# EAGLE design Helepolis_Level1 (EAGLE 6.4)
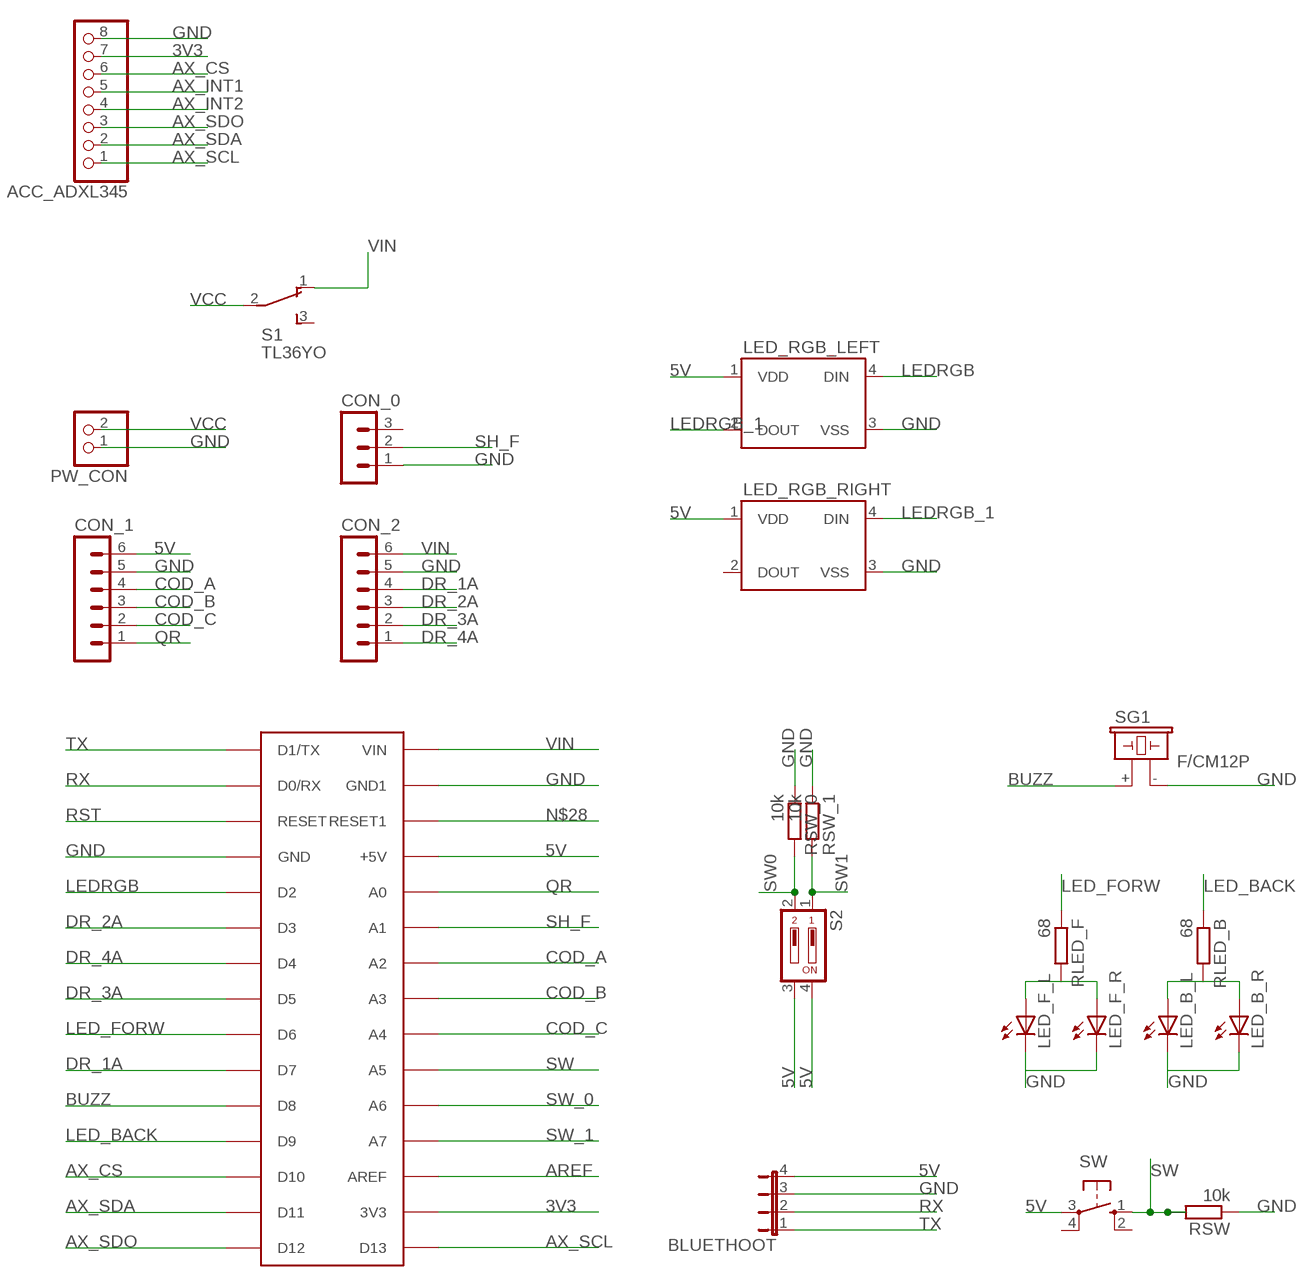
[diagram p0: schematic, sheet 1]

## Parts
ACC_ADXL345  PINHD-1X8  [1X08]
BLUETHOOT  JP4E  [JP4]
CON_0  MA03-1  [MA03-1]
CON_1  MA06-1  [MA06-1]
CON_2  MA06-1  [MA06-1]
LED_B_L  LED5MM  [LED5MM]
LED_B_R  LED5MM  [LED5MM]
LED_F_L  LED5MM  [LED5MM]
LED_F_R  LED5MM  [LED5MM]
LED_RGB_LEFT  WS2812B  [WS2812B]
LED_RGB_RIGHT  WS2812B  [WS2812B]
PW_CON  PINHD-1X2  [1X02]
RLED_B  68  R-EU_R1206  [R1206]
RLED_F  68  R-EU_R1206  [R1206]
RSW  10k  R-EU_R1206  [R1206]
RSW_0  10k  R-EU_R1206  [R1206]
RSW_1  10k  R-EU_R1206  [R1206]
S1  TL36YO  [TL3XYO]
S2  DP02  [DP-02]
SG1  F/CM12P  [F/CM12P]
SW  10-XX  [B3F-10XX]
U$1  ARDUINONANO  [PDIP-32]

## Nets
3V3: ACC_ADXL345.7 U$1.3V3
5V: BLUETHOOT.4 CON_1.6 LED_RGB_LEFT.1(VDD) LED_RGB_RIGHT.1(VDD) S2.3 S2.4 SW.3(P) U$1.+5V
AREF: U$1.AREF
AX_CS: ACC_ADXL345.6 U$1.D10
AX_INT1: ACC_ADXL345.5
AX_INT2: ACC_ADXL345.4
AX_SCL: ACC_ADXL345.1 U$1.D13
AX_SDA: ACC_ADXL345.2 U$1.D11
AX_SDO: ACC_ADXL345.3 U$1.D12
BUZZ: SG1.+ U$1.D8
COD_A: CON_1.4 U$1.A2
COD_B: CON_1.3 U$1.A3
COD_C: CON_1.2 U$1.A4
DR_1A: CON_2.4 U$1.D7
DR_2A: CON_2.3 U$1.D3
DR_3A: CON_2.2 U$1.D5
DR_4A: CON_2.1 U$1.D4
GND [GND]: ACC_ADXL345.8 BLUETHOOT.3 CON_0.1 CON_1.5 CON_2.5 LED_B_L.K(C) LED_B_R.K(C) LED_F_L.K(C) LED_F_R.K(C) LED_RGB_LEFT.3(VSS) LED_RGB_RIGHT.3(VSS) PW_CON.1 RSW.1 RSW_0.1 RSW_1.1 SG1.- U$1.GND U$1.GND1
LED_BACK: RLED_B.1 U$1.D9
LED_FORW: RLED_F.1 U$1.D6
LEDRGB: LED_RGB_LEFT.4(DIN) U$1.D2
LEDRGB_1: LED_RGB_LEFT.2(DOUT) LED_RGB_RIGHT.4(DIN)
N$4: LED_F_L.A LED_F_R.A RLED_F.2
N$5: LED_B_L.A LED_B_R.A RLED_B.2
N$28: U$1.RESET1
QR: CON_1.1 U$1.A0
RST: U$1.RESET
RX: BLUETHOOT.2 U$1.D0/RX
SH_F: CON_0.2 U$1.A1
SW: RSW.2 SW.1(S) U$1.A5
SW0: RSW_0.2 S2.2
SW1: RSW_1.2 S2.1
SW_0: U$1.A6
SW_1: U$1.A7
TX: BLUETHOOT.1 U$1.D1/TX
VCC [GND]: PW_CON.2 S1.2(P)
VIN [VCC]: CON_2.6 S1.1(O) U$1.VIN
Unconnected: CON_0.3 LED_RGB_RIGHT.2(DOUT) S1.3(S) SW.2(S1) SW.4(P1)

## Library data of the parts
ACC_ADXL345 = pinhead:PINHD-1X8: PIN HEADER
BLUETHOOT = jumper:JP4E: JUMPER
CON_0 = con-lstb:MA03-1: PIN HEADER; OC_FARNELL: unknown; OC_NEWARK: unknown
CON_1 CON_2 = con-lstb:MA06-1: PIN HEADER; OC_FARNELL: unknown; OC_NEWARK: unknown
LED_B_L LED_B_R LED_F_L LED_F_R = led:LED: LED OSRAM: - CHIPLED LG R971, LG N971, LY N971, LG Q971, LY Q971, LO R971, LY R971 LH N974, LH R974 LS Q976, LO Q976, LY Q976 LO Q996 - Hyper CHIPLED LW Q18S LB Q993, LB Q99A, LB R99A - SideLED LS A670, LO A670, LY A670, LG A670, LP A670 LB A673, LV A673, LT A673, LW A673 LH A674 LY A675 LS A676, LA A676, LO A676, LY A676, LW A676 LS A679, LY A679, LG A679 - Hyper Micro SIDELED® LS Y876, LA Y876, LO Y876, LY Y876 LT Y87S - SmartLED LW L88C, LW L88S LB L89C, LB L89S, LG L890 LS L89K, LO L89K, LY L89K LS L896, LA L896, LO L896, LY L896 - TOPLED LS T670, LO T670, LY T670, LG T670, LP T670 LSG T670, LSP T670, LSY T670, LOP T670, LYG T670 LG T671, LOG T671, LSG T671 LB T673, LV T673, LT T673, LW T673 LH T674 LS T676, LA T676, LO T676, LY T676, LB T676, LH T676, LSB T676, LW T676 LB T67C, LV T67C, LT T67C, LS T67K, LO T67K, LY T67K, LW E67C LS E67B, LA E67B, LO E67B, LY E67B, LB E67C, LV E67C, LT E67C LW T67C LS T679, LY T679, LG T679 LS T770, LO T770, LY T770, LG T770, LP T770 LB T773, LV T773, LT T773, LW T773 LH T774 LS E675, LA E675, LY E675, LS T675 LS T776, LA T776, LO T776, LY T776, LB T776 LHGB T686 LT T68C, LB T68C - Hyper Mini TOPLED® LB M676 - Mini TOPLED Santana® LG M470 LS M47K, LO M47K, LY M47K Source: http://www.osram.convergy.de LUXEON: - LUMILED® LXK2-PW12-R00, LXK2-PW12-S00, LXK2-PW14-U00, LXK2-PW14-V00 LXK2-PM12-R00, LXK2-PM12-S00, LXK2-PM14-U00 LXK2-PE12-Q00, LXK2-PE12-R00, LXK2-PE12-S00, LXK2-PE14-T00, LXK2-PE14-U00 LXK2-PB12-K00, LXK2-PB12-L00, LXK2-PB12-M00, LXK2-PB14-N00, LXK2-PB14-P00, LXK2-PB14-Q00 LXK2-PR12-L00, LXK2-PR12-M00, LXK2-PR14-Q00, LXK2-PR14-R00 LXK2-PD12-Q00, LXK2-PD12-R00, LXK2-PD12-S00 LXK2-PH12-R00, LXK2-PH12-S00 LXK2-PL12-P00, LXK2-PL12-Q00, LXK2-PL12-R00 Source: www.luxeon.com KINGBRIGHT: KA-3528ASYC Source: www.kingbright.com
LED_RGB_LEFT LED_RGB_RIGHT = SparkFun-LED_copia:WS2812B: WS2812B - Intelligent control LED integrated light source Technical Specifications: Power Supply Voltage (VDD): 3.5 to 5.3 V Input Voltage (VI): -0.5 to VDD+0.5 V Operating Junction Temperature (Topt): -25°C to +80°C Storage Temperature Range (Tstg): -55°C to +150°C
PW_CON = pinhead:PINHD-1X2: PIN HEADER
RLED_B RLED_F RSW RSW_0 RSW_1 = rcl:R-EU_: RESISTOR, European symbol
S1 = switch:TL36YO: TINY SWITCH ON - ON Source: http://www2.produktinfo.conrad.com/datenblaetter/700000-724999/705152-da-01-de-Subminiaturschalter_TL_36YO.pdf
S2 = switch-dil:DP02: DIL/CODE SWITCH; MPN: MCDP02; OC_FARNELL: 1255233; OC_NEWARK: 26M1095
SG1 = buzzer:F/CM12P: BUZZER Source: Buerklin; OC_FARNELL: unknown; OC_NEWARK: unknown
SW = switch-omron:10-XX: OMRON SWITCH; MPN: B3F-1000; OC_FARNELL: 176432; OC_NEWARK: 36M3542
U$1 = jet-lib:ARDUINONANO

## Net classes
1 GND: width 1.016 mm, clearance 0.305 mm
2 VCC: width 0.635 mm, clearance 0.305 mm to class 1

## Board
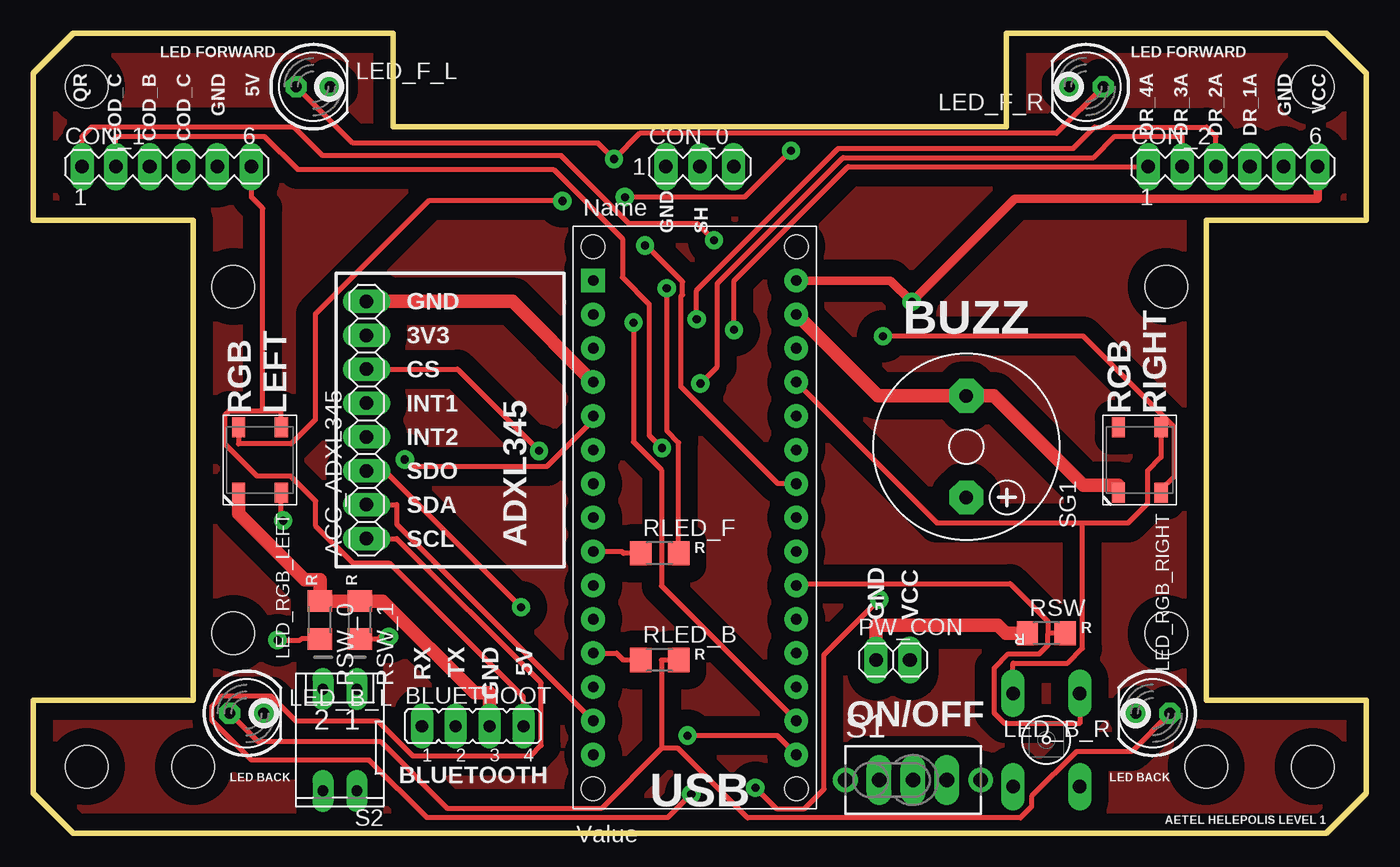
[diagram p1: board, top side]
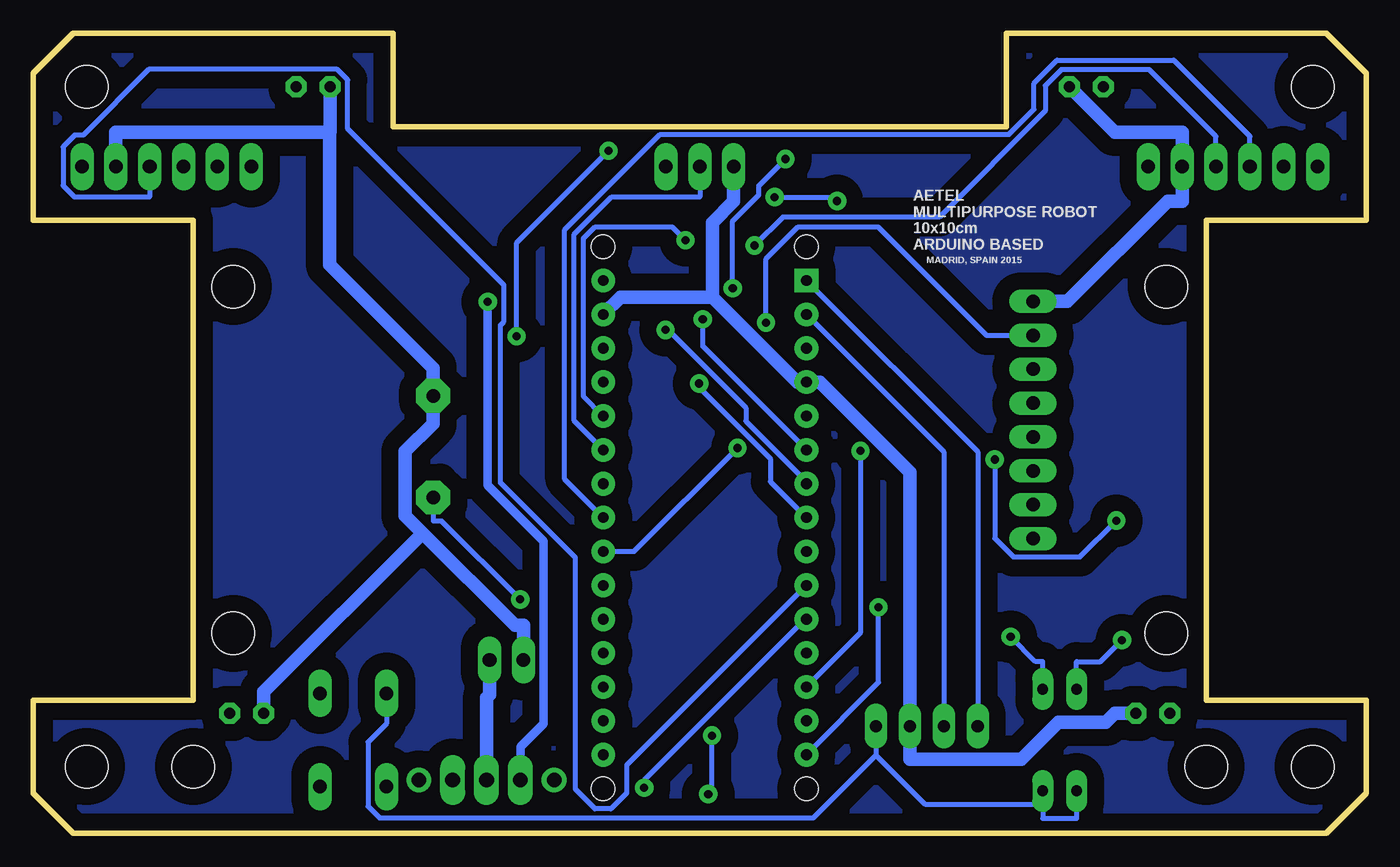
[diagram p2: board, bottom side, seen from below]

Size 100 x 60 mm. Coordinates in mm from the lower left corner, seen from the top.
Outline: 3,0 27,0
Outline: 73,0 97,0
Outline: 100,3 100,10
Outline: 100,46 100,57
Outline: 0,57 0,46
Outline: 0,10 0,3
Outline: 0,3 0,10
Outline: 0,46 12,46 12,43 12,25 12,10 0,10
Outline: 0,46 0,57
Outline: 100,57 100,46
Outline: 100,46 88,46 88,43 88,25 88,10 100,10
Outline: 100,10 100,3
Outline: 97,0 73,0
Outline: 27,0 3,0
Outline: 0,3 3,0
Outline: 100,3 97,0
Outline: 73,60 97,60 100,57
Outline: 73,0 67,0 51,0 35,0 28,0 27,0
Outline: 50,53 73,53
Outline: 73,53 73,60
Outline: 73,60 73,53
Outline: 73,53 27,53 27,60 26,60 3,60 0,57
Copper layers (1*16): Top 0.035mm / dielectric 1.5mm / Bottom 0.035mm
Design rules "default *": minimum track width 15mil, minimum drill 24mil, track to track 12mil, track to pad 12mil, pad to pad 12mil, via to via 12mil, smd to smd 8mil, copper to edge 40mil, drill to drill 8mil, minimum pad ring 15mil, minimum via ring 15mil, stop-mask expansion 4mil, vias tented up to drill 0mil, thermal gap 10mil
Holes 3.2 mm at 4,5 12,5 15,15 96,5 88,5 4,56 96,56 85,41 85,15 15,41
tRestrict: area 62,2 to 70,6; area 21,1 to 25,5; area 21,9 to 25,13

### Footprints (pad centres in the part's own frame; a part is rotated, then mirrored left to right if it is on the bottom)
1X08 = drill 1.016 long: 1 -8.89,0; 2 -6.35,0; 3 -3.81,0; 4 -1.27,0; 5 1.27,0; 6 3.81,0; 7 6.35,0; 8 8.89,0
JP4 = drill 0.914 long: 1 -3.81,0; 2 -1.27,0; 3 1.27,0; 4 3.81,0
MA03-1 = drill 1.016 long: 1 -2.54,0; 2 0,0; 3 2.54,0
MA06-1 = drill 1.016 long: 1 -6.35,0; 2 -3.81,0; 3 -1.27,0; 4 1.27,0; 5 3.81,0; 6 6.35,0
LED5MM = drill 0.813 octagon: A -1.27,0; K 1.27,0
WS2812B = smd 1.5 x 1: 1 -2.45,1.6; 2 -2.45,-1.6; 3 2.45,-1.6; 4 2.45,1.6
1X02 = drill 1.016 long: 1 -1.27,0; 2 1.27,0
R1206 = smd 1.6 x 1.803: 1 -1.422,0; 2 1.422,0
TL3XYO = drill 1.1 pad 1.422 long: 1 -2.54,0; 2 0,0; 3 2.54,0 | drill 1.1 pad 1.676: M1 -5.08,0; M2 5.08,0
DP-02 = drill 0.813 long: 1 -1.27,-3.81; 2 1.27,-3.81; 3 1.27,3.81; 4 -1.27,3.81
F/CM12P = drill 1.016 pad 2.54 octagon: + 3.81,0; - -3.81,0
B3F-10XX = drill 1.016 long: 1 -3.5,2.5; 2 3.5,2.5; 3 -3.5,-2.5; 4 3.5,-2.5
PDIP-32 = drill 0.8 pad 1.778: 3V3 15.24,-35.56; +5V 15.24,-10.16; A0 15.24,-12.7; A1 15.24,-15.24; A2 15.24,-17.78; A3 15.24,-20.32; A4 15.24,-22.86; A5 15.24,-25.4; A6 15.24,-27.94; A7 15.24,-30.48; AREF 15.24,-33.02; D0/RX 0,-5.08; D2 0,-12.7; D3 0,-15.24; D4 0,-17.78; D5 0,-20.32; D6 0,-22.86; D7 0,-25.4; D8 0,-27.94; D9 0,-30.48; D10 0,-33.02; D11 0,-35.56; D12 0,-38.1; D13 15.24,-38.1; GND 0,-10.16; GND1 15.24,-5.08; RESET 0,-7.62; RESET1 15.24,-7.62; VIN 15.24,-2.54 | drill 0.8 pad 1.778 square: D1/TX 0,-2.54 | hole 1.778: 0,0; 0,-40.64; 15.24,-40.64; 15.24,0

### Placement (x,y rotation side)
ACC_ADXL345  25,31 90 top
BLUETHOOT  32.96,8.04 0 top
CON_0  50,50 0 top
CON_1  10,50 0 top
CON_2  90,50 0 top
LED_B_L  16,9 0 top
LED_B_R  84,9 180 top
LED_F_L  21,56 0 top
LED_F_R  79,56 180 top
LED_RGB_LEFT  17,28 270 top
LED_RGB_RIGHT  83,28 270 top
PW_CON  64.5,13 0 top
RLED_B  47,13 0 top
RLED_F  47,21 0 top
RSW  76,15 0 top
RSW_0  21.5,16 270 top
RSW_1  24.5,16 270 top
S1  66,4 0 top
S2  23,7 180 top
SG1  70,29 270 top
SW  76,7 270 top
U$1  42,44 0 top

### Tracks (layer width: path | path; a pad name or v marks a point on that pad's centre or on a via)
3V3  (via drill 0.61 pad 1.37)
  Top 0.381: v45.02,38.31 45.02,29.37 47.13,27.27 47.13,18.55 U$1.3V3
  Bottom 0.381: v45.02,38.31 45.02,43.08 42.62,45.49 36.62,45.49 28.48,37.35 ACC_ADXL345.7
5V
  Top 0.381: SW.3 73.5,12.77 77.61,12.77 78.72,13.88 78.72,23.29 | 78.72,23.29 82.15,23.29 83.61,24.75 83.61,27.21 84.6,28.2 LED_RGB_RIGHT.1 | U$1.+5V 67.79,23.29 78.72,23.29 | 17.21,31.7 18.6,31.7 LED_RGB_LEFT.1 | 17.21,31.7 14.68,31.7 14.4,31.42 14.4,29.17 16.78,26.8 19.32,26.8 21.2,24.92 21.2,23.04 24,20.24 26.74,20.24 36.77,10.21 BLUETHOOT.4 | 17.21,31.7 17.21,46.87 16.35,47.73 CON_1.6
  Bottom 0.381: SW.3 73.5,8.23 74.89,6.84 74.89,2.01 74.02,1.15 41.49,1.15 36.77,5.87 | 24.27,2.15 33.06,2.15 36.77,5.87 | BLUETHOOT.4 36.77,5.87 | 24.27,2.15 24.27,1.12 21.73,1.12 S2.3 | S2.4 24.27,2.15
AX_CS  (via drill 0.61 pad 1.37)
  Top 0.381: ACC_ADXL345.6 31.83,34.81 v37.95,28.68
  Bottom 0.381: v37.95,28.68 37.95,15.03 U$1.D10
AX_SCL  (via drill 0.61 pad 1.37)
  Top 0.381: U$1.D13 55.81,7.33 v49.08,7.33 | ACC_ADXL345.1 27.27,22.11 38.11,11.28 38.11,6.59 37.33,5.82 28.46,5.82 25.85,8.44 19.68,8.44 17.81,10.3 14.17,10.3 13.41,9.55 13.41,8.46 16.38,5.5 25.21,5.5 29.53,1.17 47.59,1.17 v49.36,2.94
  Bottom 0.381: v49.36,2.94 49.08,3.22 v49.08,7.33 | v49.08,7.33
AX_SDA
  Top 0.381: ACC_ADXL345.2 27.27,24.65 27.27,23.17 U$1.D11
AX_SDO  (via drill 0.61 pad 1.37)
  Top 0.381: v36.59,16.96 26.36,27.19 ACC_ADXL345.3
  Bottom 0.381: U$1.D12 36.59,11.31 v36.59,16.96
BUZZ  (via drill 0.61 pad 1.37)
  Top 0.381: v54.17,3.43 55.75,1.84 57.86,1.84 59.33,3.31 59.33,13.4 v63.47,17.54
  Bottom 0.381: SG1.+ 70,23.43 69.36,23.43 v63.47,17.54 | U$1.D8 42.11,16.06 54.17,4 v54.17,3.43
COD_A  (via drill 0.61 pad 1.37)
  Top 0.381: U$1.A2 55.86,26.22 48.59,33.49 48.59,40.27 48.71,40.39 48.71,41.37 45.99,44.09 v45.89,44.09
  Bottom 0.381: CON_1.4 11.27,52.27 16.28,57.28 22.87,57.28 24.07,56.08 24.07,54.18 32.03,46.22 43.76,46.22 v45.89,44.09
COD_B
  Bottom 0.381: CON_1.3 8.73,52.27 14.44,57.98 23.19,57.98 24.92,56.25 24.92,54.29 26.8,52.41 52.97,52.41 60.13,45.26 60.13,26.57 U$1.A3
COD_C  (via drill 0.61 pad 1.37)
  Top 0.381: CON_1.2 6.19,52.27 17.34,52.27 19.82,49.79 39.02,49.79 44.2,44.6 44.2,41.7 46.21,39.7 46.21,29.86 v47.17,28.9
  Bottom 0.381: U$1.A4 54.92,21.14 v47.17,28.9
DR_1A
  Bottom 0.381: CON_2.4 91.27,47.73 96.93,47.73 97.77,48.57 97.77,51.49 96.9,52.36 96.25,52.36 91.33,57.29 77.19,57.29 76.4,56.5 76.4,52.83 64.69,41.12 64.69,38.37 64.94,38.11 64.94,26.29 59.33,20.67 59.33,3.31 57.86,1.84 56.66,1.84 55.48,3.02 55.48,5.12 U$1.D7
DR_2A  (via drill 0.61 pad 1.37)
  Top 0.381: CON_2.3 88.73,52.27 88.04,52.96 79.61,52.96 78.02,51.37 60.4,51.37 49.77,40.74 v49.77,38.56
  Bottom 0.381: U$1.D3 49.77,36.53 v49.77,38.56
DR_3A  (via drill 0.61 pad 1.37)
  Top 0.381: CON_2.2 86.19,52.27 81.14,52.27 79.56,50.69 60.75,50.69 51.31,41.25 51.31,35.01 v50.05,33.73
  Bottom 0.381: v50.05,33.73 50.05,33.45 44.71,28.11 44.71,26.39 U$1.D5
DR_4A  (via drill 0.61 pad 1.37)
  Top 0.381: v52.57,37.76 52.57,41.45 61.12,50 CON_2.1
  Bottom 0.381: v52.57,37.76 52.39,37.76 46.54,31.9 46.54,30.91 42,26.37 U$1.D4
GND
  Top 1.016: PW_CON.1 63.23,15.59 72.37,15.59 72.97,15 RSW.1 | U$1.GND1 63.35,32.81 67.92,32.81 SG1.- 72.08,32.81 78.78,26.11 81.4,26.11 LED_RGB_RIGHT.3 | U$1.GND 35.95,39.89 ACC_ADXL345.8 | BLUETHOOT.3 34.23,10.53 33.11,10.53 26.21,17.42 RSW_1.1 RSW_0.1 21.5,19.04 20.35,19.04 15.4,23.99 LED_RGB_LEFT.3
  Bottom 1.016: 49.06,40.22 49.06,45.81 47.46,47.41 CON_0.1 | 49.06,40.22 42.68,33.84 U$1.GND 40.99,33.84 34.23,27.08 34.23,10.53 BLUETHOOT.3 34.23,7.89 34.23,5.55 25.87,5.55 23.08,8.34 19.53,8.34 18.87,9 LED_B_L.K | U$1.GND1 55.94,40.22 49.06,40.22 | 70.81,22.52 82.73,10.6 LED_B_R.K | 70.81,22.52 63.87,15.59 63.23,15.59 PW_CON.1 | 70.81,22.52 72.09,23.81 72.09,28.64 70,30.73 SG1.- 70,33.85 70,34.89 77.76,42.65 77.76,52.59 | 77.76,52.59 77.73,52.62 LED_F_R.K | 77.76,52.59 93.81,52.59 CON_2.5 | LED_F_L.K 18.86,52.59 13.81,52.59 CON_1.5 13.81,47.41 14.89,47.41 22.41,39.89 ACC_ADXL345.8
LED_BACK
  Top 0.381: RLED_B.1 44.28,13 43.76,13.52 U$1.D9
LED_FORW
  Top 0.381: RLED_F.1 44.28,21 44.14,21.14 U$1.D6
LEDRGB  (via drill 0.61 pad 1.37)
  Top 0.381: v18.75,23.45 18.6,23.6 LED_RGB_LEFT.4 | U$1.D2 42,30.99 38.51,27.5 28.4,27.5 v27.87,28.04
  Bottom 0.381: v27.87,28.04 27.87,22.11 26.48,20.73 21.48,20.73 v18.75,23.45
LEDRGB_1  (via drill 0.61 pad 1.37)
  Top 0.381: LED_RGB_RIGHT.4 84.6,25.8 85.59,26.79 85.59,30.45 78.77,37.28 v63.74,37.28 | LED_RGB_LEFT.2 15.4,29.2 19.35,29.2 21.16,31.01 21.16,38.94 29.65,47.43 v39.7,47.43 | v56.84,51.19 53.37,47.72 v44.38,47.72
  Bottom 0.381: v44.38,47.72 39.99,47.72 v39.7,47.43 | v63.74,37.28 63.74,44.29 v56.84,51.19
N$1
  pour Bottom (isolate 1.27): 0,10 0,3 3,0 97,0 100,3 100,10 88,10 88,46 100,46 100,57 97,60 73,60 73,53 27,53 27,60 3,60 0,57 0,46 12,46 12,10
N$2
  pour Top (isolate 1.27): 0,10 0,3 3,0 97,0 100,3 100,10 88,10 88,46 100,46 100,57 97,60 73,60 73,53 27,53 27,60 3,60 0,57 0,46 12,46 12,10
N$4  (via drill 0.61 pad 1.37)
  Top 0.381: v47.53,40.88 47.53,30.2 48.42,29.31 48.42,22.4 RLED_F.2 | LED_F_R.A 76.76,52.49 45.49,52.49 v43.56,50.57 42.38,51.76 23.97,51.76 LED_F_L.A
  Bottom 0.381: v47.53,40.88 47.53,45.92 45.57,47.88 45.57,48.57 v43.56,50.57
N$5
  Top 0.381: 47.13,6.36 42.62,1.86 31.08,1.86 26.08,6.85 16.88,6.85 LED_B_L.A | 47.13,6.36 47.13,13 RLED_B.2 | LED_B_R.A 82.4,6.13 78.26,6.13 74.9,2.77 74.9,2 74.06,1.16 53.58,1.16 48.38,6.36 47.13,6.36
QR  (via drill 0.61 pad 1.37)
  Top 0.381: CON_1.1 3.65,52.27 4.34,52.97 19.55,52.97 21.69,50.83 39.61,50.83 44.7,45.73 49.82,45.73 v51.06,44.48
  Bottom 0.381: U$1.A0 58.73,32.79 58.73,44.62 57.85,45.49 52.07,45.49 v51.06,44.48
RX
  Bottom 0.381: U$1.D0/RX 31.69,28.61 BLUETHOOT.2
SH_F
  Bottom 0.381: CON_0.2 50,47.73 56.62,47.73 59.42,44.92 59.42,30.95 U$1.A1
SW
  Top 0.381: 76.13,15 RSW.2 76.13,15 | SW.1 78.5,8.23 72.88,8.23 72.09,9.01 72.09,12.4 73.16,13.46 75.48,13.46 76.13,14.11 76.13,15 | U$1.A5 57.37,18.73 73.29,18.73 76.13,15.89 76.13,15
SW0  (via drill 0.61 pad 1.37)
  Top 0.381: RSW_0.2 20.1,14.58 20.02,14.49 v18.32,14.49
  Bottom 0.381: S2.2 21.73,12.88 19.93,12.88 v18.32,14.49
SW1  (via drill 0.61 pad 1.37)
  Top 0.381: RSW_1.2 25.9,14.58 26.06,14.74 v26.67,14.74
  Bottom 0.381: S2.1 24.27,12.88 24.82,12.88 v26.67,14.74
TX
  Bottom 0.381: U$1.D1/TX 29.15,28.61 BLUETHOOT.1
VCC
  Bottom 1.016: PW_CON.2 65.77,10.41 66,10.18 S1.2
VIN  (via drill 0.61 pad 1.37)
  Top 0.635: U$1.VIN 64.32,41.46 v65.91,39.87 73.63,47.6 96.35,47.6 CON_2.6
  Bottom 0.635: S1.1 63.46,6.48 61.71,8.23 61.71,21.91 65.91,26.1 v65.91,39.87

### Text on the board
_tsilk: LED FORWARD | LED FORWARD | QR / COD_C / COD_B / COD_C / GND / 5V | DR_4A / DR_3A / DR_2A / DR_1A / GND / VCC | GND / SH | BUZZ | RGB / LEFT | RGB / RIGHT | GND / 3V3 / CS / INT1 / INT2 / SDO / SDA / SCL | ADXL345 | R | R | R | GND / VCC | R | R | RX / TX / GND / 5V | R | ON/OFF | BLUETOOTH | LED BACK | LED BACK | USB | AETEL HELEPOLIS LEVEL 1
_bsilk: AETEL / MULTIPURPOSE ROBOT / 10x10cm / ARDUINO BASED | MADRID, SPAIN 2015
200bmp: C:/Users/PABLO/Desktop/AETEL_Logo.bmp